# Altium schematic sheet ESP32 backup.SchDoc: ESP32
size 342 x 241 mm; DrawnBy: Kace Chandler; DocumentNumber: 14; SheetNumber: 14; SheetTotal: 23
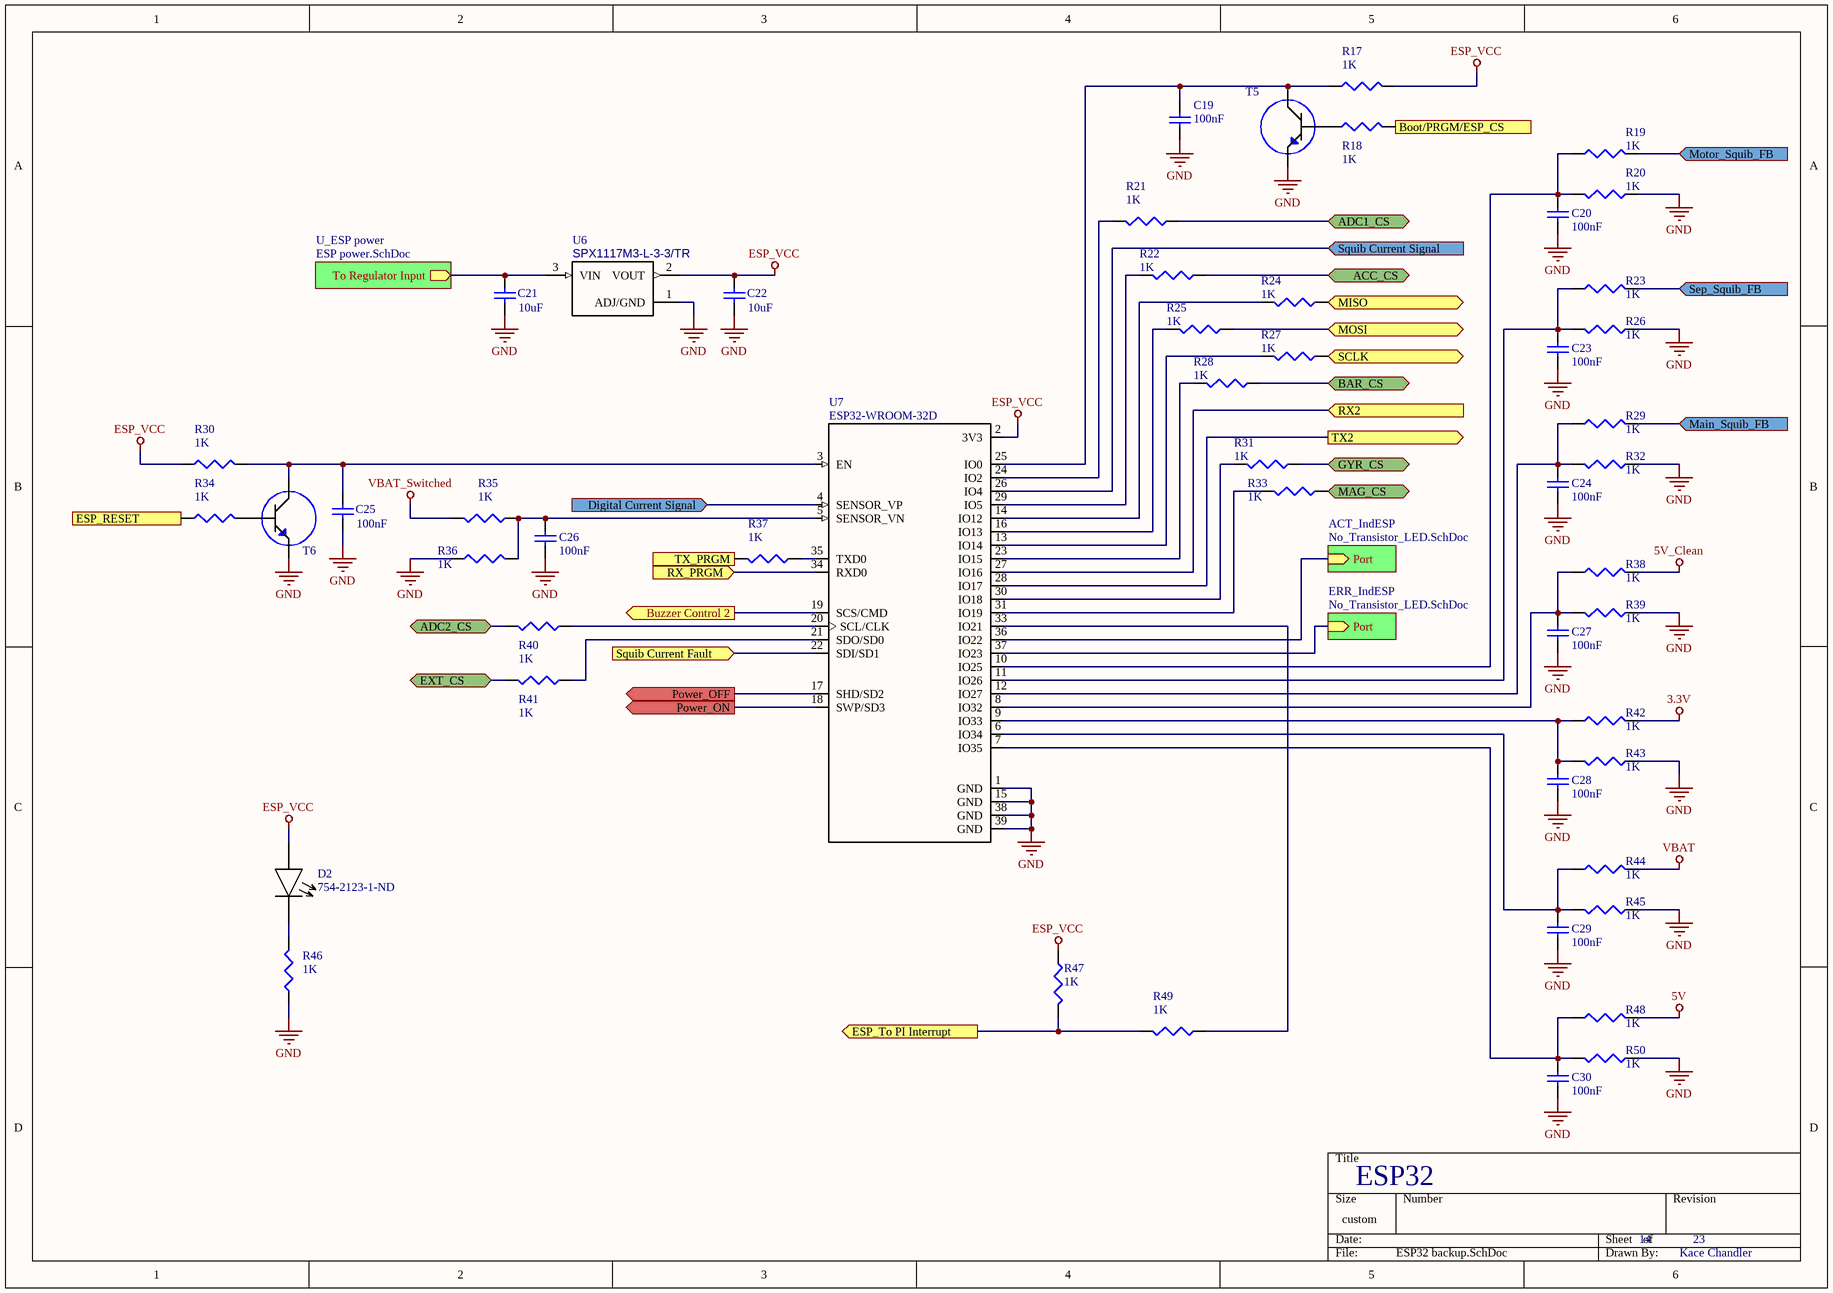
[diagram p0: ESP32 backup.SchDoc]

## Parts
C19  value 100nF  [0805 Footprint]  (hidden comment: Cap)
C20  value 100nF  [0603 Footprint]  (hidden comment: Cap)
C21  value 10uF  [0805 Footprint]  (hidden comment: Cap)
C22  value 10uF  [0805 Footprint]  (hidden comment: Cap)
C23  value 100nF  [0603 Footprint]  (hidden comment: Cap)
C24  value 100nF  [0603 Footprint]  (hidden comment: Cap)
C25  value 100nF  [0805 Footprint]  (hidden comment: Cap)
C26  value 100nF  [0603 Footprint]  (hidden comment: Cap)
C27  value 100nF  [0603 Footprint]  (hidden comment: Cap)
C28  value 100nF  [0603 Footprint]  (hidden comment: Cap)
C29  value 100nF  [0603 Footprint]  (hidden comment: Cap)
C30  value 100nF  [0603 Footprint]  (hidden comment: Cap)
D2  Supplier Part Number 1: 754-2123-1-ND  [0402 footprint]  (hidden comment: LED_R)
R17  value 1K  (hidden comment: Res3)
R18  value 1K  (hidden comment: Res3)
R19  value 1K  (hidden comment: Res3)
R20  value 1K  (hidden comment: Res3)
R21  value 1K  (hidden comment: Res3)
R22  value 1K  (hidden comment: Res3)
R23  value 1K  (hidden comment: Res3)
R24  value 1K  (hidden comment: Res3)
R25  value 1K  (hidden comment: Res3)
R26  value 1K  (hidden comment: Res3)
R27  value 1K  (hidden comment: Res3)
R28  value 1K  (hidden comment: Res3)
R29  value 1K  (hidden comment: Res3)
R30  value 1K  (hidden comment: Res3)
R31  value 1K  (hidden comment: Res3)
R32  value 1K  (hidden comment: Res3)
R33  value 1K  (hidden comment: Res3)
R34  value 1K  (hidden comment: Res3)
R35  value 1K  (hidden comment: Res3)
R36  value 1K  (hidden comment: Res3)
R37  value 1K  (hidden comment: Res3)
R38  value 1K  (hidden comment: Res3)
R39  value 1K  (hidden comment: Res3)
R40  value 1K  (hidden comment: Res3)
R41  value 1K  (hidden comment: Res3)
R42  value 1K  (hidden comment: Res3)
R43  value 1K  (hidden comment: Res3)
R44  value 1K  (hidden comment: Res3)
R45  value 1K  (hidden comment: Res3)
R46  value 1K  (hidden comment: Res3)
R47  value 1K  [J1-0603]  (hidden comment: Res3)
R48  value 1K  (hidden comment: Res3)
R49  value 1K  (hidden comment: Res3)
R50  value 1K  (hidden comment: Res3)
T5  MMBT2222ALT1  [BJT]  (value not drawn)
T6  MMBT2222ALT1  [BJT]  (value not drawn)
U6  MP: SPX1117M3-L-3-3/TR  [*DPAK229P990X238-4N]  (hidden comment: 3.3V Regulator)
U7  ESP32-WROOM-32D  [*MODULE_ESP32-WROOM-32D]

## Sub-sheets
ACT_IndESP = No_Transistor_LED.SchDoc: Port (in)
ERR_IndESP = No_Transistor_LED.SchDoc: Port (in)
U_ESP power = ESP power.SchDoc: To Regulator Input (out)

## Ports
ACC_CS (bidir), ADC1_CS (bidir), ADC2_CS (bidir), BAR_CS (bidir), Boot/PRGM/ESP_CS (in), Buzzer Control 2 (out), Digital Current Signal (in), ESP_RESET (in), ESP_To PI Interrupt (out), EXT_CS (bidir), GYR_CS (bidir), MAG_CS (bidir), Main_Squib_FB (in), MISO (bidir), MOSI (bidir), Motor_Squib_FB (in), Power_OFF (out), Power_ON (out), RX2 (in), RX_PRGM (in), SCLK (bidir), Sep_Squib_FB (in), Squib Current Fault (in), Squib Current Signal (in), TX2 (out), TX_PRGM (out)

## Nets
3.3V: R42.2
5V: R48.2
5V_Clean: R38.2
ESP_VCC: C22.2 D2.1 R17.1 R30.1 R47.1 U6.2(VOUT) U7.2(3V3)
GND: C19.1 C20.1 C21.1 C22.1 C23.1 C24.1 C25.1 C26.1 C27.1 C28.1 C29.1 C30.1 R20.1 R26.1 R32.1 R36.1 R39.1 R43.1 R45.1 R46.1 R50.1 T5.2(E) T6.2(E) U6.1(ADJ/GND) U7.1(GND) U7.15(GND) U7.38(GND) U7.39(GND)
VBAT: R44.2
VBAT_Switched: R35.2
ACC_CS: R22.1 ; port ACC_CS
ADC1_CS: R21.1 ; port ADC1_CS
ADC2_CS: R40.2 ; port ADC2_CS
BAR_CS: R28.1 ; port BAR_CS
Boot/PRGM/ESP_CS: R18.2 ; port Boot/PRGM/ESP_CS
Buzzer Control 2: U7.19(SCS/CMD) ; port Buzzer Control 2
Digital Current Signal: U7.4(SENSOR_VP) ; port Digital Current Signal
ESP_RESET: R34.1 ; port ESP_RESET
ESP_To PI Interrupt: R47.2 R49.2 ; port ESP_To PI Interrupt
EXT_CS: R41.2 ; port EXT_CS
GYR_CS: R31.1 ; port GYR_CS
MAG_CS: R33.1 ; port MAG_CS
Main_Squib_FB: R29.2 ; port Main_Squib_FB
MISO: R24.1 ; port MISO
MOSI: R25.1 ; port MOSI
Motor_Squib_FB: R19.2 ; port Motor_Squib_FB
Power_OFF: U7.17(SHD/SD2) ; port Power_OFF
Power_ON: U7.18(SWP/SD3) ; port Power_ON
RX2: U7.27(IO16) ; port RX2
RX_PRGM: U7.34(RXD0) ; port RX_PRGM
SCLK: R27.1 ; port SCLK
Sep_Squib_FB: R23.2 ; port Sep_Squib_FB
Squib Current Fault: U7.22(SDI/SD1) ; port Squib Current Fault
Squib Current Signal: U7.26(IO4) ; port Squib Current Signal
TX2: U7.28(IO17) ; port TX2
TX_PRGM: R37.2 ; port TX_PRGM
NetC19_2: C19.2 R17.2 T5.3(C) U7.25(IO0)
NetC20_2: C20.2 R19.1 R20.2 U7.10(IO25)
NetC21_2: C21.2 U6.3(VIN) ; sheet U_ESP power/To Regulator Input
NetC23_2: C23.2 R23.1 R26.2 U7.11(IO26)
NetC24_2: C24.2 R29.1 R32.2 U7.12(IO27)
NetC25_2: C25.2 R30.2 T6.3(C) U7.3(EN)
NetC26_2: C26.2 R35.1 R36.2 U7.5(SENSOR_VN)
NetC27_2: C27.2 R38.1 R39.2 U7.8(IO32)
NetC28_2: C28.2 R42.1 R43.2 U7.9(IO33)
NetC29_2: C29.2 R44.1 R45.2 U7.6(IO34)
NetC30_2: C30.2 R48.1 R50.2 U7.7(IO35)
NetD2_2: D2.2 R46.2
NetR18_1: R18.1 T5.1(B)
NetR21_2: R21.2 U7.24(IO2)
NetR22_2: R22.2 U7.29(IO5)
NetR24_2: R24.2 U7.14(IO12)
NetR25_2: R25.2 U7.16(IO13)
NetR27_2: R27.2 U7.13(IO14)
NetR28_2: R28.2 U7.23(IO15)
NetR31_2: R31.2 U7.30(IO18)
NetR33_2: R33.2 U7.31(IO19)
NetR34_2: R34.2 T6.1(B)
NetR37_1: R37.1 U7.35(TXD0)
NetR40_1: R40.1 U7.20(SCL/CLK)
NetR41_1: R41.1 U7.21(SDO/SD0)
NetR49_1: R49.1 U7.33(IO21)
NetU7_36: U7.36(IO22) ; sheet ACT_IndESP/Port
NetU7_37: U7.37(IO23) ; sheet ERR_IndESP/Port

## Library data of the parts
C20-C24 C26-C30 = Cap: Capacitor; Published: 8-Jun-2000; LatestRevisionDate: 17-Jul-2002; LatestRevisionNote: Re-released for DXP Platform.; PackageReference: RAD-0.3; Publisher: Altium Limited; PackageDescription: Radial Cap, Thru-Hole; 2 Leads; 0.3 in Pin Spacing
R17-R50 = Res3: Resistor; Published: 8-Jun-2000; LatestRevisionDate: 29-May-2009; LatestRevisionNote: IPC-7351 Footprint Added.; PackageReference: J1-0603; Publisher: Altium Limited; PackageDescription: Chip Resistor
T5 T6 = BJT NPN: Trans NPN 40V 0.6A SOT23; MF: ON Semiconductor; SnapEDA_Link: https://www.snapeda.com/parts/MMBT2222ALT1/ON%20Semiconductor/view-part/?ref=snap; Price: None; Availability: Unavailable; MP: MMBT2222ALT1; Package: SOT-23 Motorola; Value: *; Supplier 1: Digi-Key; Supplier Part Number 1: MMBT2222ATPMSCT-ND
U6 = 3-3VReg: NCP1117DT33T5GOSCT-ND 3.3V linear regulator; MF: MaxLinear, Inc.; Availability: Unavailable; Price: None; Package: SOT-223 Exar; SnapEDA_Link: https://www.snapeda.com/parts/SPX1117M3-L-3-3/TR/MaxLinear%2C%20Inc./view-part/?ref=snap; Value: *; Supplier 1: Digi-Key; Supplier Part Number 1: NCP1117DT33T5GOSCT-ND
U7 = ESP32-WROOM-32D: IC: SoC; GPIO, I2C, I2S, IR, SD, SDIO, SPI, UART; 2.7Ã·3.6VDC; 20dBm; MF: Espressif Systems; SnapEDA_Link: https://www.snapeda.com/parts/ESP32-WROOM-32D/Espressif%20Systems/view-part/?ref=snap; Availability: Unavailable; Package: Module Espressif Systems; Price: None; MP: ESP32-WROOM-32D; Value: *; Supplier 1: Digi-Key; Supplier Part Number 1: 1904-1023-1-ND
D2 = LED_R: Supplier 1: Digi-Key